# Altium schematic sheet Top.SchDoc
size A4; Organization: TESLA Motors, INC; Address1: 3500 Deer Creek Road; Address2: Palo Alto, CA; Address4: U.S.A.; SheetNumber: 1; SheetTotal: 8
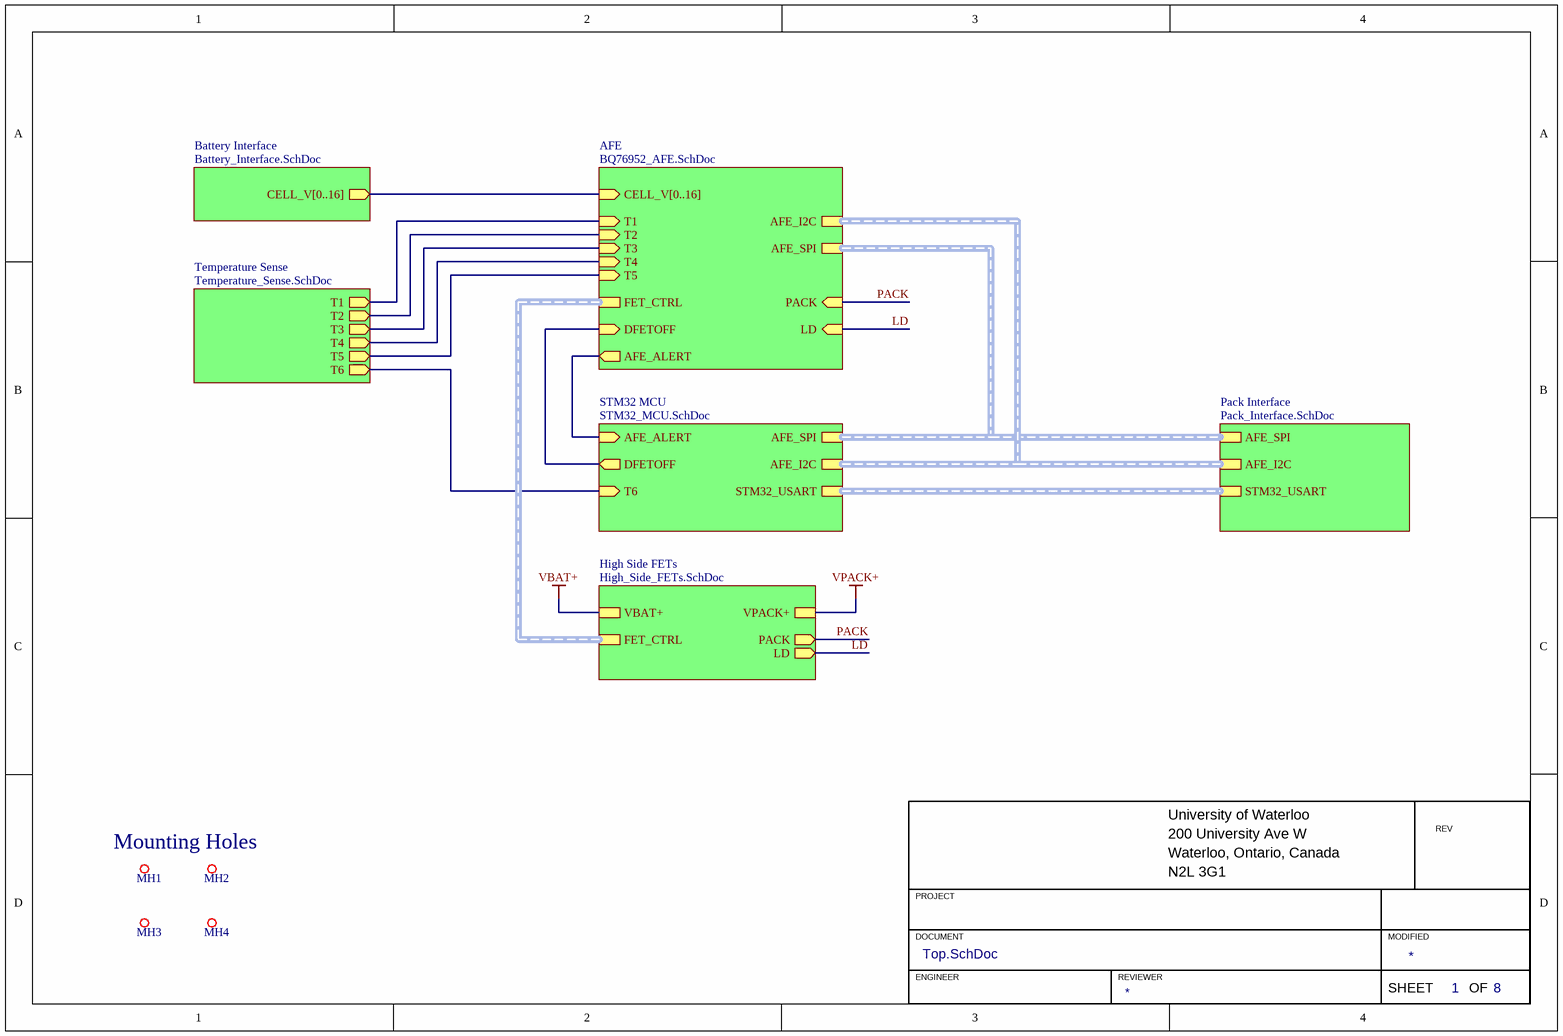
[diagram p0: Top.SchDoc]

## Parts
MH1  MOUNTING_HOLE_M3  [MOUNTING_HOLE_3mm]  (value not drawn)  (no BOM)
MH2  MOUNTING_HOLE_M3  [MOUNTING_HOLE_3mm]  (value not drawn)  (no BOM)
MH3  MOUNTING_HOLE_M3  [MOUNTING_HOLE_3mm]  (value not drawn)  (no BOM)
MH4  MOUNTING_HOLE_M3  [MOUNTING_HOLE_3mm]  (value not drawn)  (no BOM)

## Sub-sheets
AFE = BQ76952_AFE.SchDoc: CELL_V[0..16] (in), AFE_SPI (harness SPI), AFE_ALERT (out), T1 (in), T2 (in), T3 (in), DFETOFF (in), FET_CTRL (harness FET_CTRL), PACK (in), LD (in), AFE_I2C (harness I2C), T4 (in), T5 (in)
Battery Interface = Battery_Interface.SchDoc: CELL_V[0..16] (out)
High Side FETs = High_Side_FETs.SchDoc: LD (out), PACK (out), VPACK+, FET_CTRL (harness FET_CTRL), VBAT+
Pack Interface = Pack_Interface.SchDoc: STM32_USART (harness USART), AFE_SPI (harness SPI), AFE_I2C (harness I2C)
STM32 MCU = STM32_MCU.SchDoc: AFE_SPI (harness SPI), STM32_USART (harness USART), AFE_ALERT (in), DFETOFF (out), T6 (in), AFE_I2C (harness I2C)
Temperature Sense = Temperature_Sense.SchDoc: T1 (out), T2 (out), T3 (out), T6 (out), T4 (out), T5 (out)

## Nets
VBAT+: sheet High Side FETs/VBAT+
VPACK+: sheet High Side FETs/VPACK+
LD: sheet AFE/LD, sheet High Side FETs/LD
PACK: sheet AFE/PACK, sheet High Side FETs/PACK
(unnamed): sheet AFE/AFE_ALERT, sheet STM32 MCU/AFE_ALERT
(unnamed): sheet AFE/T1, sheet Temperature Sense/T1
(unnamed): sheet AFE/T2, sheet Temperature Sense/T2
(unnamed): sheet AFE/T3, sheet Temperature Sense/T3
(unnamed): sheet AFE/DFETOFF, sheet STM32 MCU/DFETOFF
(unnamed): sheet AFE/T4, sheet Temperature Sense/T4
(unnamed): sheet AFE/T5, sheet Temperature Sense/T5
(unnamed): sheet Temperature Sense/T6, sheet STM32 MCU/T6

## Buses and harness runs
bus sheet AFE/CELL_V[0..16] = sheet Battery Interface/CELL_V[0..16]
harness sheet AFE/AFE_I2C = sheet Pack Interface/AFE_I2C = sheet STM32 MCU/AFE_I2C
harness sheet AFE/AFE_SPI = sheet Pack Interface/AFE_SPI = sheet STM32 MCU/AFE_SPI
harness sheet AFE/FET_CTRL = sheet High Side FETs/FET_CTRL
harness sheet Pack Interface/STM32_USART = sheet STM32 MCU/STM32_USART

## Notes on the sheet
- Mounting Holes
- University of Waterloo
- 200 University Ave W
- REV
- PROJECT
- Waterloo, Ontario, Canada
- N2L 3G1
- DOCUMENT
- ENGINEER
- REVIEWER
- MODIFIED
- SHEET
- OF